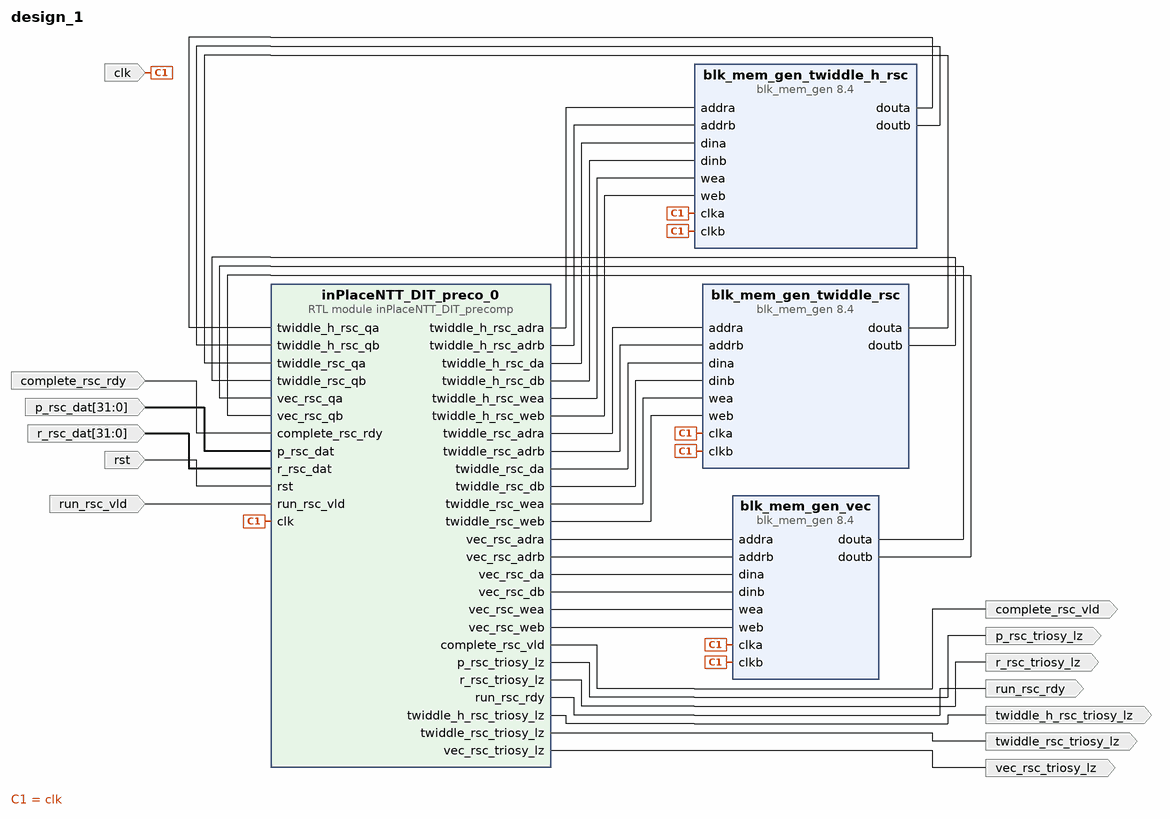
[diagram p0: block diagram of the top level]
# Vivado block design design_1, xcku115-flvb2104-2-e, Vivado 2021.1
create_bd_design design_1

create_bd_port -dir I -type clk clk
set_property -dict {CONFIG.FREQ_HZ 100000000} [get_bd_ports clk]
create_bd_port -dir I -type rst rst
create_bd_port -dir I run_rsc_vld
create_bd_port -dir I complete_rsc_rdy
create_bd_port -dir O run_rsc_rdy
create_bd_port -dir O complete_rsc_vld
create_bd_port -dir I -from 31 -to 0 p_rsc_dat
create_bd_port -dir I -from 31 -to 0 r_rsc_dat
create_bd_port -dir O vec_rsc_triosy_lz
create_bd_port -dir O p_rsc_triosy_lz
create_bd_port -dir O r_rsc_triosy_lz
create_bd_port -dir O twiddle_rsc_triosy_lz
create_bd_port -dir O twiddle_h_rsc_triosy_lz

create_bd_cell -type module -reference inPlaceNTT_DIT_precomp inPlaceNTT_DIT_preco_0
create_bd_cell -type ip -vlnv xilinx.com:ip:blk_mem_gen:8.4 blk_mem_gen_vec
set_property -dict [list \
  CONFIG.EN_SAFETY_CKT true \
  CONFIG.Enable_32bit_Address true \
  CONFIG.Enable_B Use_ENB_Pin \
  CONFIG.Memory_Type True_Dual_Port_RAM \
  CONFIG.Operating_Mode_A WRITE_FIRST \
  CONFIG.Operating_Mode_B WRITE_FIRST \
  CONFIG.Port_B_Clock 100 \
  CONFIG.Port_B_Enable_Rate 100 \
  CONFIG.Port_B_Write_Rate 50 \
  CONFIG.Register_PortA_Output_of_Memory_Primitives false \
  CONFIG.Register_PortB_Output_of_Memory_Primitives false \
  CONFIG.Use_RSTA_Pin true \
  CONFIG.Use_RSTB_Pin true \
  CONFIG.use_bram_block BRAM_Controller \
] [get_bd_cells blk_mem_gen_vec]
create_bd_cell -type ip -vlnv xilinx.com:ip:blk_mem_gen:8.4 blk_mem_gen_twiddle_rsc
set_property -dict [list \
  CONFIG.Assume_Synchronous_Clk false \
  CONFIG.EN_SAFETY_CKT true \
  CONFIG.Enable_32bit_Address true \
  CONFIG.Enable_B Use_ENB_Pin \
  CONFIG.Memory_Type True_Dual_Port_RAM \
  CONFIG.Operating_Mode_A WRITE_FIRST \
  CONFIG.Operating_Mode_B WRITE_FIRST \
  CONFIG.Port_B_Clock 100 \
  CONFIG.Port_B_Enable_Rate 100 \
  CONFIG.Port_B_Write_Rate 50 \
  CONFIG.Read_Width_A 32 \
  CONFIG.Read_Width_B 32 \
  CONFIG.Register_PortA_Output_of_Memory_Primitives false \
  CONFIG.Register_PortB_Output_of_Memory_Primitives false \
  CONFIG.Use_RSTA_Pin true \
  CONFIG.Use_RSTB_Pin true \
  CONFIG.Write_Width_A 32 \
  CONFIG.Write_Width_B 32 \
  CONFIG.use_bram_block BRAM_Controller \
] [get_bd_cells blk_mem_gen_twiddle_rsc]
create_bd_cell -type ip -vlnv xilinx.com:ip:blk_mem_gen:8.4 blk_mem_gen_twiddle_h_rsc
set_property -dict [list \
  CONFIG.EN_SAFETY_CKT true \
  CONFIG.Enable_32bit_Address true \
  CONFIG.Enable_B Use_ENB_Pin \
  CONFIG.Memory_Type True_Dual_Port_RAM \
  CONFIG.Operating_Mode_A WRITE_FIRST \
  CONFIG.Operating_Mode_B WRITE_FIRST \
  CONFIG.Port_B_Clock 100 \
  CONFIG.Port_B_Enable_Rate 100 \
  CONFIG.Port_B_Write_Rate 50 \
  CONFIG.Register_PortA_Output_of_Memory_Primitives false \
  CONFIG.Register_PortB_Output_of_Memory_Primitives false \
  CONFIG.Use_RSTA_Pin true \
  CONFIG.Use_RSTB_Pin true \
  CONFIG.use_bram_block BRAM_Controller \
] [get_bd_cells blk_mem_gen_twiddle_h_rsc]

# ---- connections ----

connect_bd_net [get_bd_pins blk_mem_gen_twiddle_h_rsc/douta] [get_bd_pins inPlaceNTT_DIT_preco_0/twiddle_h_rsc_qa]
connect_bd_net [get_bd_pins blk_mem_gen_twiddle_h_rsc/doutb] [get_bd_pins inPlaceNTT_DIT_preco_0/twiddle_h_rsc_qb]
connect_bd_net [get_bd_pins blk_mem_gen_twiddle_rsc/douta] [get_bd_pins inPlaceNTT_DIT_preco_0/twiddle_rsc_qa]
connect_bd_net [get_bd_pins blk_mem_gen_twiddle_rsc/doutb] [get_bd_pins inPlaceNTT_DIT_preco_0/twiddle_rsc_qb]
connect_bd_net [get_bd_pins blk_mem_gen_vec/douta] [get_bd_pins inPlaceNTT_DIT_preco_0/vec_rsc_qa]
connect_bd_net [get_bd_pins blk_mem_gen_vec/doutb] [get_bd_pins inPlaceNTT_DIT_preco_0/vec_rsc_qb]
connect_bd_net [get_bd_ports clk] \
  [get_bd_pins inPlaceNTT_DIT_preco_0/clk] [get_bd_pins blk_mem_gen_vec/clka] [get_bd_pins blk_mem_gen_vec/clkb] \
  [get_bd_pins blk_mem_gen_twiddle_rsc/clka] [get_bd_pins blk_mem_gen_twiddle_rsc/clkb] \
  [get_bd_pins blk_mem_gen_twiddle_h_rsc/clkb] [get_bd_pins blk_mem_gen_twiddle_h_rsc/clka]
connect_bd_net [get_bd_ports complete_rsc_rdy] [get_bd_pins inPlaceNTT_DIT_preco_0/complete_rsc_rdy]
connect_bd_net [get_bd_pins inPlaceNTT_DIT_preco_0/complete_rsc_vld] [get_bd_ports complete_rsc_vld]
connect_bd_net [get_bd_pins inPlaceNTT_DIT_preco_0/p_rsc_triosy_lz] [get_bd_ports p_rsc_triosy_lz]
connect_bd_net [get_bd_pins inPlaceNTT_DIT_preco_0/r_rsc_triosy_lz] [get_bd_ports r_rsc_triosy_lz]
connect_bd_net [get_bd_pins inPlaceNTT_DIT_preco_0/run_rsc_rdy] [get_bd_ports run_rsc_rdy]
connect_bd_net [get_bd_pins inPlaceNTT_DIT_preco_0/twiddle_h_rsc_adra] [get_bd_pins blk_mem_gen_twiddle_h_rsc/addra]
connect_bd_net [get_bd_pins inPlaceNTT_DIT_preco_0/twiddle_h_rsc_adrb] [get_bd_pins blk_mem_gen_twiddle_h_rsc/addrb]
connect_bd_net [get_bd_pins inPlaceNTT_DIT_preco_0/twiddle_h_rsc_da] [get_bd_pins blk_mem_gen_twiddle_h_rsc/dina]
connect_bd_net [get_bd_pins inPlaceNTT_DIT_preco_0/twiddle_h_rsc_db] [get_bd_pins blk_mem_gen_twiddle_h_rsc/dinb]
connect_bd_net [get_bd_pins inPlaceNTT_DIT_preco_0/twiddle_h_rsc_triosy_lz] [get_bd_ports twiddle_h_rsc_triosy_lz]
connect_bd_net [get_bd_pins inPlaceNTT_DIT_preco_0/twiddle_h_rsc_wea] [get_bd_pins blk_mem_gen_twiddle_h_rsc/wea]
connect_bd_net [get_bd_pins inPlaceNTT_DIT_preco_0/twiddle_h_rsc_web] [get_bd_pins blk_mem_gen_twiddle_h_rsc/web]
connect_bd_net [get_bd_pins inPlaceNTT_DIT_preco_0/twiddle_rsc_adra] [get_bd_pins blk_mem_gen_twiddle_rsc/addra]
connect_bd_net [get_bd_pins inPlaceNTT_DIT_preco_0/twiddle_rsc_adrb] [get_bd_pins blk_mem_gen_twiddle_rsc/addrb]
connect_bd_net [get_bd_pins inPlaceNTT_DIT_preco_0/twiddle_rsc_da] [get_bd_pins blk_mem_gen_twiddle_rsc/dina]
connect_bd_net [get_bd_pins inPlaceNTT_DIT_preco_0/twiddle_rsc_db] [get_bd_pins blk_mem_gen_twiddle_rsc/dinb]
connect_bd_net [get_bd_pins inPlaceNTT_DIT_preco_0/twiddle_rsc_triosy_lz] [get_bd_ports twiddle_rsc_triosy_lz]
connect_bd_net [get_bd_pins inPlaceNTT_DIT_preco_0/twiddle_rsc_wea] [get_bd_pins blk_mem_gen_twiddle_rsc/wea]
connect_bd_net [get_bd_pins inPlaceNTT_DIT_preco_0/twiddle_rsc_web] [get_bd_pins blk_mem_gen_twiddle_rsc/web]
connect_bd_net [get_bd_pins inPlaceNTT_DIT_preco_0/vec_rsc_adra] [get_bd_pins blk_mem_gen_vec/addra]
connect_bd_net [get_bd_pins inPlaceNTT_DIT_preco_0/vec_rsc_adrb] [get_bd_pins blk_mem_gen_vec/addrb]
connect_bd_net [get_bd_pins inPlaceNTT_DIT_preco_0/vec_rsc_da] [get_bd_pins blk_mem_gen_vec/dina]
connect_bd_net [get_bd_pins inPlaceNTT_DIT_preco_0/vec_rsc_db] [get_bd_pins blk_mem_gen_vec/dinb]
connect_bd_net [get_bd_pins inPlaceNTT_DIT_preco_0/vec_rsc_triosy_lz] [get_bd_ports vec_rsc_triosy_lz]
connect_bd_net [get_bd_pins inPlaceNTT_DIT_preco_0/vec_rsc_wea] [get_bd_pins blk_mem_gen_vec/wea]
connect_bd_net [get_bd_pins inPlaceNTT_DIT_preco_0/vec_rsc_web] [get_bd_pins blk_mem_gen_vec/web]
connect_bd_net [get_bd_ports p_rsc_dat] [get_bd_pins inPlaceNTT_DIT_preco_0/p_rsc_dat]
connect_bd_net [get_bd_ports r_rsc_dat] [get_bd_pins inPlaceNTT_DIT_preco_0/r_rsc_dat]
connect_bd_net [get_bd_ports rst] [get_bd_pins inPlaceNTT_DIT_preco_0/rst]
connect_bd_net [get_bd_ports run_rsc_vld] [get_bd_pins inPlaceNTT_DIT_preco_0/run_rsc_vld]

validate_bd_design
save_bd_design
